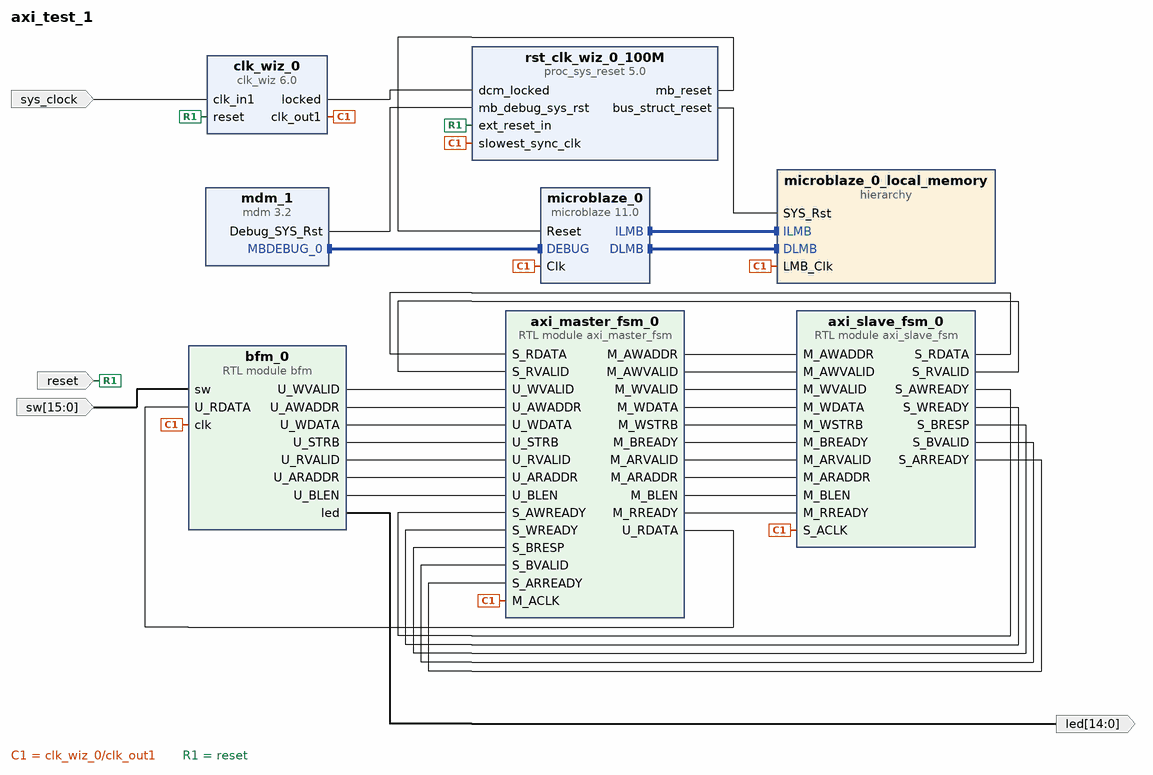
[diagram p0: block diagram of the top level]
# Vivado block design axi_test_1, xc7a35tcpg236-1, Vivado 2019.2
create_bd_design axi_test_1

create_bd_port -dir I -type clk sys_clock
set_property -dict {CONFIG.ASSOCIATED_RESET reset CONFIG.FREQ_HZ 100000000 CONFIG.PHASE 0.000} [get_bd_ports sys_clock]
create_bd_port -dir I -from 15 -to 0 sw
create_bd_port -dir O -from 14 -to 0 led
create_bd_port -dir I -type rst reset
set_property -dict {CONFIG.POLARITY ACTIVE_LOW} [get_bd_ports reset]

create_bd_cell -type ip -vlnv xilinx.com:ip:clk_wiz:6.0 clk_wiz_0
set_property -dict [list \
  CONFIG.CLK_IN1_BOARD_INTERFACE sys_clock \
  CONFIG.RESET_BOARD_INTERFACE reset \
  CONFIG.USE_BOARD_FLOW true \
] [get_bd_cells clk_wiz_0]
create_bd_cell -type ip -vlnv xilinx.com:ip:microblaze:11.0 microblaze_0
set_property -dict [list \
  CONFIG.C_ADDR_TAG_BITS 0 \
  CONFIG.C_AREA_OPTIMIZED 1 \
  CONFIG.C_DCACHE_ADDR_TAG 0 \
  CONFIG.C_DEBUG_ENABLED 1 \
  CONFIG.C_D_AXI 1 \
  CONFIG.C_D_LMB 1 \
  CONFIG.C_I_LMB 1 \
  CONFIG.C_USE_BARREL 1 \
  CONFIG.C_USE_HW_MUL 1 \
  CONFIG.C_USE_MSR_INSTR 1 \
  CONFIG.C_USE_PCMP_INSTR 1 \
  CONFIG.C_USE_REORDER_INSTR 0 \
  CONFIG.G_TEMPLATE_LIST 8 \
] [get_bd_cells microblaze_0]
create_bd_cell -type hier microblaze_0_local_memory
create_bd_cell -type ip -vlnv xilinx.com:ip:mdm:3.2 mdm_1
create_bd_cell -type ip -vlnv xilinx.com:ip:proc_sys_reset:5.0 rst_clk_wiz_0_100M
set_property -dict {CONFIG.RESET_BOARD_INTERFACE reset CONFIG.USE_BOARD_FLOW true} [get_bd_cells rst_clk_wiz_0_100M]
create_bd_cell -type module -reference axi_master_fsm axi_master_fsm_0
create_bd_cell -type module -reference axi_slave_fsm axi_slave_fsm_0
create_bd_cell -type module -reference bfm bfm_0

# ---- hierarchy /microblaze_0_local_memory ----
current_bd_instance /microblaze_0_local_memory
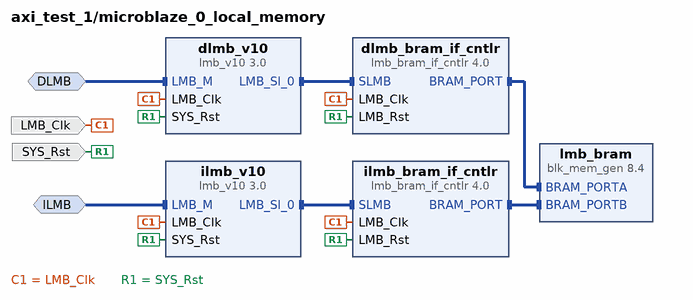
[diagram p1: block diagram inside /microblaze_0_local_memory]
create_bd_intf_pin -mode MirroredMaster -vlnv xilinx.com:interface:lmb_rtl:1.0 DLMB
create_bd_intf_pin -mode MirroredMaster -vlnv xilinx.com:interface:lmb_rtl:1.0 ILMB
create_bd_pin -dir I -type clk LMB_Clk
create_bd_pin -dir I -type rst SYS_Rst

create_bd_cell -type ip -vlnv xilinx.com:ip:lmb_v10:3.0 dlmb_v10
create_bd_cell -type ip -vlnv xilinx.com:ip:lmb_v10:3.0 ilmb_v10
create_bd_cell -type ip -vlnv xilinx.com:ip:lmb_bram_if_cntlr:4.0 dlmb_bram_if_cntlr
set_property -dict {CONFIG.C_ECC 0} [get_bd_cells dlmb_bram_if_cntlr]
create_bd_cell -type ip -vlnv xilinx.com:ip:lmb_bram_if_cntlr:4.0 ilmb_bram_if_cntlr
set_property -dict {CONFIG.C_ECC 0} [get_bd_cells ilmb_bram_if_cntlr]
create_bd_cell -type ip -vlnv xilinx.com:ip:blk_mem_gen:8.4 lmb_bram
set_property -dict {CONFIG.Memory_Type True_Dual_Port_RAM CONFIG.use_bram_block BRAM_Controller} [get_bd_cells lmb_bram]

# ---- connections ----

current_bd_instance /microblaze_0_local_memory
connect_bd_intf_net -intf_net microblaze_0_dlmb [get_bd_intf_pins DLMB] [get_bd_intf_pins dlmb_v10/LMB_M]
connect_bd_intf_net -intf_net microblaze_0_ilmb_bus [get_bd_intf_pins ilmb_v10/LMB_Sl_0] [get_bd_intf_pins ilmb_bram_if_cntlr/SLMB]
connect_bd_intf_net -intf_net microblaze_0_ilmb_cntlr [get_bd_intf_pins ilmb_bram_if_cntlr/BRAM_PORT] [get_bd_intf_pins lmb_bram/BRAM_PORTB]
connect_bd_intf_net -intf_net microblaze_0_dlmb_bus [get_bd_intf_pins dlmb_v10/LMB_Sl_0] [get_bd_intf_pins dlmb_bram_if_cntlr/SLMB]
connect_bd_intf_net -intf_net microblaze_0_dlmb_cntlr [get_bd_intf_pins dlmb_bram_if_cntlr/BRAM_PORT] [get_bd_intf_pins lmb_bram/BRAM_PORTA]
connect_bd_intf_net -intf_net microblaze_0_ilmb [get_bd_intf_pins ILMB] [get_bd_intf_pins ilmb_v10/LMB_M]
connect_bd_net -net microblaze_0_Clk [get_bd_pins LMB_Clk] \
  [get_bd_pins dlmb_v10/LMB_Clk] [get_bd_pins dlmb_bram_if_cntlr/LMB_Clk] [get_bd_pins ilmb_v10/LMB_Clk] \
  [get_bd_pins ilmb_bram_if_cntlr/LMB_Clk]
connect_bd_net [get_bd_pins SYS_Rst] \
  [get_bd_pins dlmb_v10/SYS_Rst] [get_bd_pins dlmb_bram_if_cntlr/LMB_Rst] [get_bd_pins ilmb_v10/SYS_Rst] \
  [get_bd_pins ilmb_bram_if_cntlr/LMB_Rst]
set_property HDL_ATTRIBUTE.BMM_INFO_ADDRESS_SPACE {byte  0x00000000 32 > axi_test_1 microblaze_0_local_memory/lmb_bram} [get_bd_cells dlmb_bram_if_cntlr]
set_property HDL_ATTRIBUTE.KEEP_HIERARCHY yes [get_bd_cells dlmb_bram_if_cntlr]

current_bd_instance /
connect_bd_intf_net [get_bd_intf_pins microblaze_0/ILMB] [get_bd_intf_pins microblaze_0_local_memory/ILMB]
connect_bd_intf_net [get_bd_intf_pins mdm_1/MBDEBUG_0] [get_bd_intf_pins microblaze_0/DEBUG]
connect_bd_intf_net [get_bd_intf_pins microblaze_0/DLMB] [get_bd_intf_pins microblaze_0_local_memory/DLMB]
connect_bd_net -net microblaze_0_Clk [get_bd_pins clk_wiz_0/clk_out1] \
  [get_bd_pins microblaze_0/Clk] [get_bd_pins microblaze_0_local_memory/LMB_Clk] \
  [get_bd_pins rst_clk_wiz_0_100M/slowest_sync_clk] [get_bd_pins axi_master_fsm_0/M_ACLK] \
  [get_bd_pins axi_slave_fsm_0/S_ACLK] [get_bd_pins bfm_0/clk]
connect_bd_net [get_bd_pins clk_wiz_0/locked] [get_bd_pins rst_clk_wiz_0_100M/dcm_locked]
connect_bd_net [get_bd_pins rst_clk_wiz_0_100M/mb_reset] [get_bd_pins microblaze_0/Reset]
connect_bd_net [get_bd_pins rst_clk_wiz_0_100M/bus_struct_reset] [get_bd_pins microblaze_0_local_memory/SYS_Rst]
connect_bd_net [get_bd_pins mdm_1/Debug_SYS_Rst] [get_bd_pins rst_clk_wiz_0_100M/mb_debug_sys_rst]
connect_bd_net [get_bd_ports sys_clock] [get_bd_pins clk_wiz_0/clk_in1]
connect_bd_net [get_bd_pins axi_master_fsm_0/M_AWADDR] [get_bd_pins axi_slave_fsm_0/M_AWADDR]
connect_bd_net [get_bd_pins axi_master_fsm_0/M_AWVALID] [get_bd_pins axi_slave_fsm_0/M_AWVALID]
connect_bd_net [get_bd_pins axi_master_fsm_0/M_WVALID] [get_bd_pins axi_slave_fsm_0/M_WVALID]
connect_bd_net [get_bd_pins axi_master_fsm_0/M_WDATA] [get_bd_pins axi_slave_fsm_0/M_WDATA]
connect_bd_net [get_bd_pins axi_master_fsm_0/M_WSTRB] [get_bd_pins axi_slave_fsm_0/M_WSTRB]
connect_bd_net [get_bd_pins axi_master_fsm_0/M_BREADY] [get_bd_pins axi_slave_fsm_0/M_BREADY]
connect_bd_net [get_bd_pins axi_master_fsm_0/M_ARVALID] [get_bd_pins axi_slave_fsm_0/M_ARVALID]
connect_bd_net [get_bd_pins axi_master_fsm_0/M_ARADDR] [get_bd_pins axi_slave_fsm_0/M_ARADDR]
connect_bd_net [get_bd_pins axi_master_fsm_0/M_BLEN] [get_bd_pins axi_slave_fsm_0/M_BLEN]
connect_bd_net [get_bd_pins axi_master_fsm_0/M_RREADY] [get_bd_pins axi_slave_fsm_0/M_RREADY]
connect_bd_net [get_bd_pins axi_slave_fsm_0/S_RDATA] [get_bd_pins axi_master_fsm_0/S_RDATA]
connect_bd_net [get_bd_pins axi_slave_fsm_0/S_RVALID] [get_bd_pins axi_master_fsm_0/S_RVALID]
connect_bd_net [get_bd_pins axi_slave_fsm_0/S_AWREADY] [get_bd_pins axi_master_fsm_0/S_AWREADY]
connect_bd_net [get_bd_pins axi_slave_fsm_0/S_WREADY] [get_bd_pins axi_master_fsm_0/S_WREADY]
connect_bd_net [get_bd_pins axi_slave_fsm_0/S_BRESP] [get_bd_pins axi_master_fsm_0/S_BRESP]
connect_bd_net [get_bd_pins axi_slave_fsm_0/S_BVALID] [get_bd_pins axi_master_fsm_0/S_BVALID]
connect_bd_net [get_bd_pins axi_slave_fsm_0/S_ARREADY] [get_bd_pins axi_master_fsm_0/S_ARREADY]
connect_bd_net -net sw_0_1 [get_bd_ports sw] [get_bd_pins bfm_0/sw]
connect_bd_net [get_bd_pins axi_master_fsm_0/U_RDATA] [get_bd_pins bfm_0/U_RDATA]
connect_bd_net [get_bd_pins bfm_0/U_WVALID] [get_bd_pins axi_master_fsm_0/U_WVALID]
connect_bd_net [get_bd_pins bfm_0/U_AWADDR] [get_bd_pins axi_master_fsm_0/U_AWADDR]
connect_bd_net [get_bd_pins bfm_0/U_WDATA] [get_bd_pins axi_master_fsm_0/U_WDATA]
connect_bd_net [get_bd_pins bfm_0/U_STRB] [get_bd_pins axi_master_fsm_0/U_STRB]
connect_bd_net [get_bd_pins bfm_0/U_RVALID] [get_bd_pins axi_master_fsm_0/U_RVALID]
connect_bd_net [get_bd_pins bfm_0/U_ARADDR] [get_bd_pins axi_master_fsm_0/U_ARADDR]
connect_bd_net [get_bd_pins bfm_0/U_BLEN] [get_bd_pins axi_master_fsm_0/U_BLEN]
connect_bd_net [get_bd_pins bfm_0/led] [get_bd_ports led]
connect_bd_net -net reset_0_1 [get_bd_ports reset] [get_bd_pins clk_wiz_0/reset] [get_bd_pins rst_clk_wiz_0_100M/ext_reset_in]
set_property HDL_ATTRIBUTE.BMM_INFO_PROCESSOR {microblaze-le > axi_test_1 microblaze_0_local_memory/dlmb_bram_if_cntlr} [get_bd_cells microblaze_0]
set_property HDL_ATTRIBUTE.KEEP_HIERARCHY yes [get_bd_cells microblaze_0]

# ---- address map ----
assign_bd_address -offset 0x00000000 -range 8K -target_address_space [get_bd_addr_spaces microblaze_0/Data] [get_bd_addr_segs microblaze_0_local_memory/dlmb_bram_if_cntlr/SLMB/Mem]
assign_bd_address -offset 0x00000000 -range 8K -target_address_space [get_bd_addr_spaces microblaze_0/Instruction] [get_bd_addr_segs microblaze_0_local_memory/ilmb_bram_if_cntlr/SLMB/Mem]

validate_bd_design
save_bd_design
